# Altium schematic sheet ExtensionConnector.SchDoc
size A4; Revision: C.2(PCB.SCH)
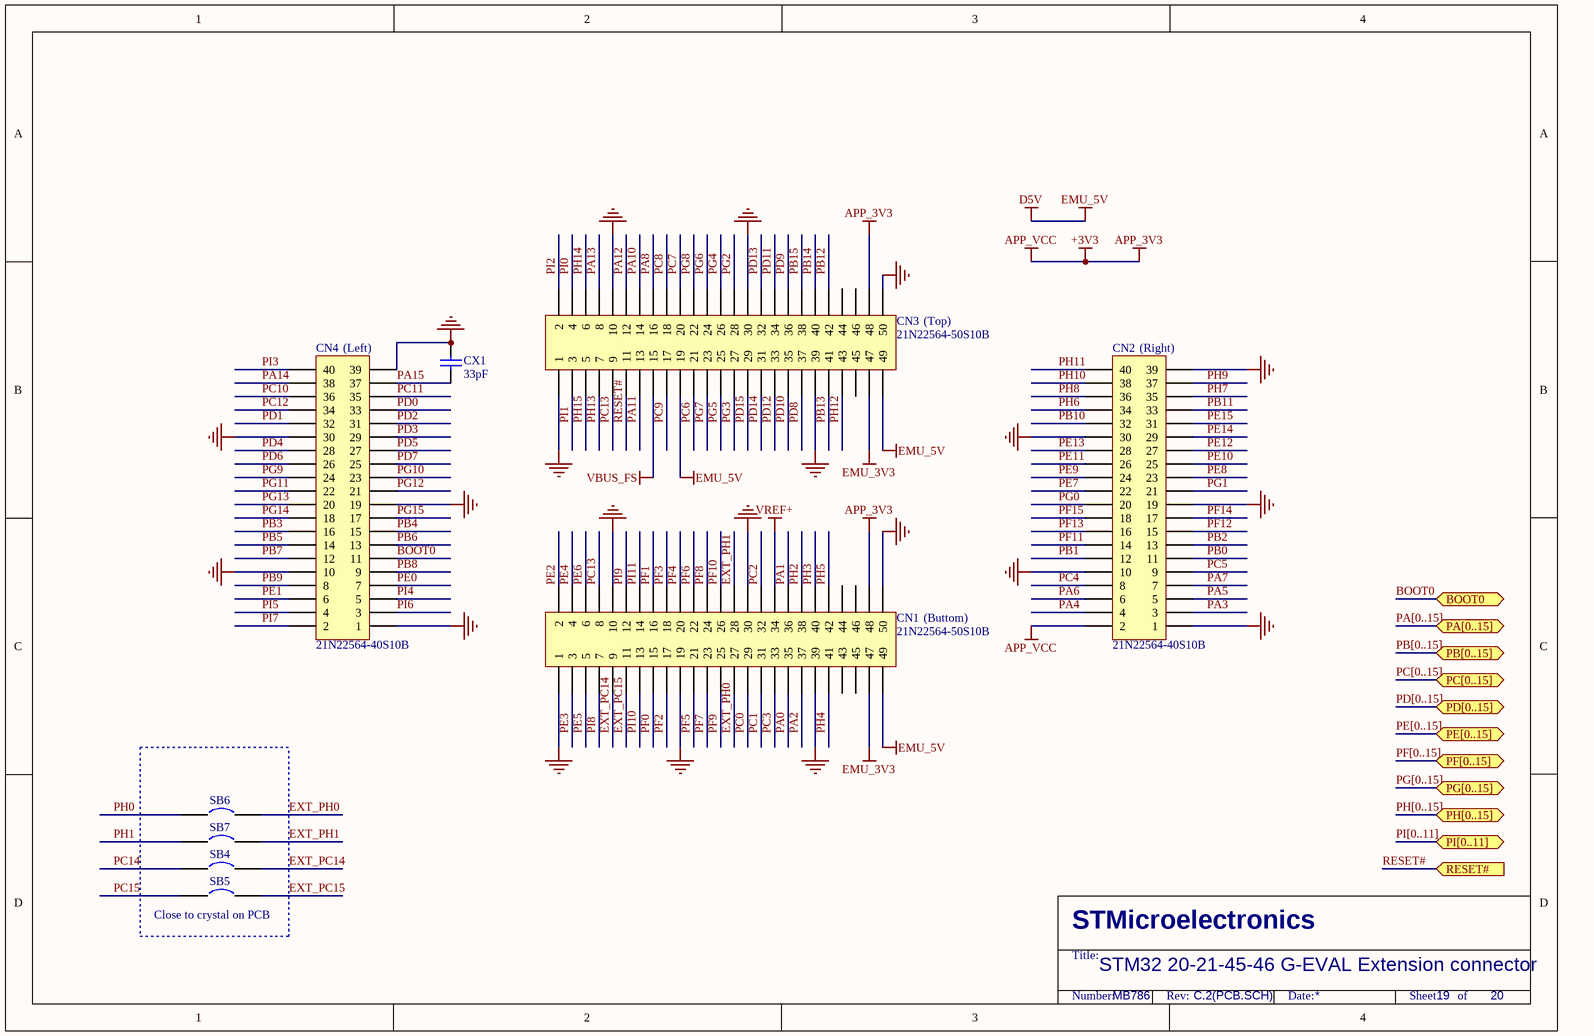
[diagram p0: ExtensionConnector.SchDoc]

## Parts
CN1  21N22564-50S10B  [2*25p]
CN2  21N22564-40S10B  [2*20p]
CN3  21N22564-50S10B  [2*25p]
CN4  21N22564-40S10B  [2*20p]
CX1  33pF  [0402C]
SB4  (no value)  [JP2_SMD]
SB5  (no value)  [JP2_SMD]
SB6  (no value)  [JP2_SMD]
SB7  (no value)  [JP2_SMD]

## Blocks framed on the sheet
Close to crystal on PCB: SB4-SB7

## Ports
BOOT0 (bidir), PA[0..15] (bidir), PB[0..15] (bidir), PC[0..15] (bidir), PD[0..15] (bidir), PE[0..15] (bidir), PF[0..15] (bidir), PG[0..15] (bidir), PH[0..15] (bidir), PI[0..11] (bidir), RESET# (in)

## Nets
+3V3: CN1.48 CN2.2 CN3.48  [also labelled APP_3V3, APP_VCC]
D5V: CN1.49 CN3.19 CN3.49  [also labelled EMU_5V]
EMU_3V3: CN1.47 CN3.47
GND: CN1.1 CN1.10 CN1.19 CN1.30 CN1.39 CN1.50 CN2.1 CN2.10 CN2.19 CN2.30 CN2.39 CN3.1 CN3.10 CN3.30 CN3.39 CN3.50 CN4.1 CN4.10 CN4.19 CN4.30 CN4.39 CX1.2
VBUS_FS: CN3.15
VREF+: CN1.34
BOOT0: CN4.11 ; port BOOT0
EXT_PC14: CN1.9 SB4.2
EXT_PC15: CN1.11 SB5.2
EXT_PH0: CN1.27 SB6.2
EXT_PH1: CN1.28 SB7.2
PA0: CN1.35
PA1: CN1.36
PA2: CN1.37
PA3: CN2.3
PA4: CN2.4
PA5: CN2.5
PA6: CN2.6
PA7: CN2.7
PA8: CN3.16
PA10: CN3.14
PA11: CN3.13
PA12: CN3.12
PA13: CN3.8
PA14: CN4.38
PA15: CN4.37 CX1.1
PB0: CN2.11
PB1: CN2.12
PB2: CN2.13
PB3: CN4.16
PB4: CN4.15
PB5: CN4.14
PB6: CN4.13
PB7: CN4.12
PB8: CN4.9
PB9: CN4.8
PB10: CN2.32
PB11: CN2.33
PB12: CN3.42
PB13: CN3.41
PB14: CN3.40
PB15: CN3.38
PC0: CN1.29
PC1: CN1.31
PC2: CN1.32
PC3: CN1.33
PC4: CN2.8
PC5: CN2.9
PC6: CN3.21
PC7: CN3.20
PC8: CN3.18
PC9: CN3.17
PC10: CN4.36
PC11: CN4.35
PC12: CN4.34
PC13: CN1.8 CN3.9
PC14: SB4.1
PC15: SB5.1
PD0: CN4.33
PD1: CN4.32
PD2: CN4.31
PD3: CN4.29
PD4: CN4.28
PD5: CN4.27
PD6: CN4.26
PD7: CN4.25
PD8: CN3.37
PD9: CN3.36
PD10: CN3.35
PD11: CN3.34
PD12: CN3.33
PD13: CN3.32
PD14: CN3.31
PD15: CN3.29
PE0: CN4.7
PE1: CN4.6
PE2: CN1.2
PE3: CN1.3
PE4: CN1.4
PE5: CN1.5
PE6: CN1.6
PE7: CN2.22
PE8: CN2.23
PE9: CN2.24
PE10: CN2.25
PE11: CN2.26
PE12: CN2.27
PE13: CN2.28
PE14: CN2.29
PE15: CN2.31
PF0: CN1.15
PF1: CN1.16
PF2: CN1.17
PF3: CN1.18
PF4: CN1.20
PF5: CN1.21
PF6: CN1.22
PF7: CN1.23
PF8: CN1.24
PF9: CN1.25
PF10: CN1.26
PF11: CN2.14
PF12: CN2.15
PF13: CN2.16
PF14: CN2.17
PF15: CN2.18
PG0: CN2.20
PG1: CN2.21
PG2: CN3.28
PG3: CN3.27
PG4: CN3.26
PG5: CN3.25
PG6: CN3.24
PG7: CN3.23
PG8: CN3.22
PG9: CN4.24
PG10: CN4.23
PG11: CN4.22
PG12: CN4.21
PG13: CN4.20
PG14: CN4.18
PG15: CN4.17
PH0: SB6.1
PH1: SB7.1
PH2: CN1.38
PH3: CN1.40
PH4: CN1.41
PH5: CN1.42
PH6: CN2.34
PH7: CN2.35
PH8: CN2.36
PH9: CN2.37
PH10: CN2.38
PH11: CN2.40
PH12: CN3.43
PH13: CN3.7
PH14: CN3.6
PH15: CN3.5
PI0: CN3.4
PI1: CN3.3
PI2: CN3.2
PI3: CN4.40
PI4: CN4.5
PI5: CN4.4
PI6: CN4.3
PI7: CN4.2
PI8: CN1.7
PI9: CN1.12
PI10: CN1.13
PI11: CN1.14
RESET#: CN3.11 ; port RESET#

Not connected (* = marked no-connect by the designer): CN1 43 44 45 46; CN3 44 45 46

## Buses and harness runs
bus PA[0..15] = port PA[0..15]
bus PB[0..15] = port PB[0..15]
bus PC[0..15] = port PC[0..15]
bus PD[0..15] = port PD[0..15]
bus PE[0..15] = port PE[0..15]
bus PF[0..15] = port PF[0..15]
bus PG[0..15] = port PG[0..15]
bus PH[0..15] = port PH[0..15]
bus PI[0..11] = port PI[0..11]

## Notes on the sheet
- (near CN4) (Left)
- (near CN3) (Top)
- (near CN2) (Right)
- (near CN1) (Buttom)
- STM32 20-21-45-46 G-EVAL Extension connector
- MB786
- 19
- 20
- STMicroelectronics
- Title:
- Number:
- Rev:
- Date:
- Sheet       of

## Library data of the parts
CN1 CN3 = Header 25X2: Header, 25-Pin, Dual row; Revision: 17-Jul-2002: Re-released for DXP Platform.; Publisher: Altium Limited
CN2 CN4 = Header 20X2: Header, 20-Pin, Dual row; Revision: 17-Jul-2002: Re-released for DXP Platform.; Publisher: Altium Limited
CX1 = Cap: Capacitor; Value: 10nF; Published: 8-Jun-2000; Revision: July-2002: Re-released for DXP Platform.; Publisher: Altium Limited
SB4-SB7 = Circuit Breaker: Published: 24-Mar-1999; Revision: July-2002: Re-released for DXP Platform.; Publisher: Altium Limited